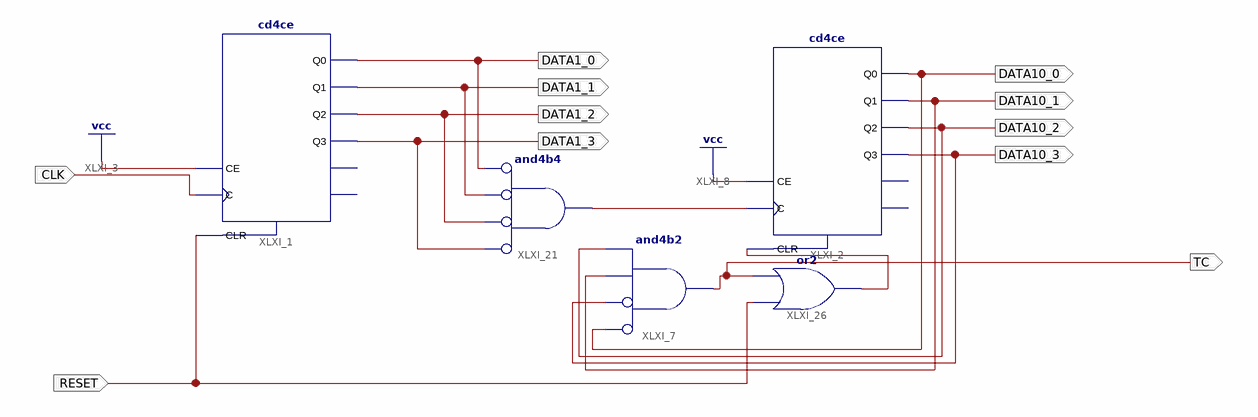
[diagram p0: schematic sheet 1]
// Xilinx ISE schematic counter00_59.sch (spartan6) as structural Verilog: 5 symbols, 11 ports
module counter00_59 (
  input  CLK,
  input  RESET,
  output DATA10_0,
  output DATA10_1,
  output DATA10_2,
  output DATA10_3,
  output TC,
  output DATA1_2,
  output DATA1_1,
  output DATA1_0,
  output DATA1_3
);

  wire XLXN_68, XLXN_86;

  cd4ce XLXI_2 (
    .C(XLXN_68), .CE(1'b1), .CLR(XLXN_86), .Q0(DATA10_0), .Q1(DATA10_1), .Q2(DATA10_2), .Q3(DATA10_3));  // open: CEO, TC
  and XLXI_7 (TC, ~DATA10_0, ~DATA10_3, DATA10_1, DATA10_2);  // and4b2
  and XLXI_21 (XLXN_68, ~DATA1_3, ~DATA1_2, ~DATA1_1, ~DATA1_0);  // and4b4
  cd4ce XLXI_1 (
    .C(CLK), .CE(1'b1), .CLR(RESET), .Q0(DATA1_0), .Q1(DATA1_1), .Q2(DATA1_2), .Q3(DATA1_3));  // open: CEO, TC
  or XLXI_26 (XLXN_86, RESET, TC);
endmodule
